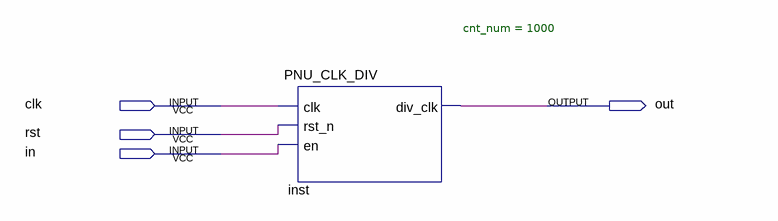
[diagram p0: schematic sheet]
// Quartus schematic testPiezo.bdf as structural Verilog: 1 symbols, 4 pins
module testPiezo (
  input  clk,
  input  rst,
  input  in,
  output out
);

  PNU_CLK_DIV #(.cnt_num(1000)) inst (.clk(clk), .rst_n(rst), .en(in), .div_clk(out));
endmodule
